# Altium schematic sheet POWER.SchDoc
size A4; SheetNumber: 4; SheetTotal: 4
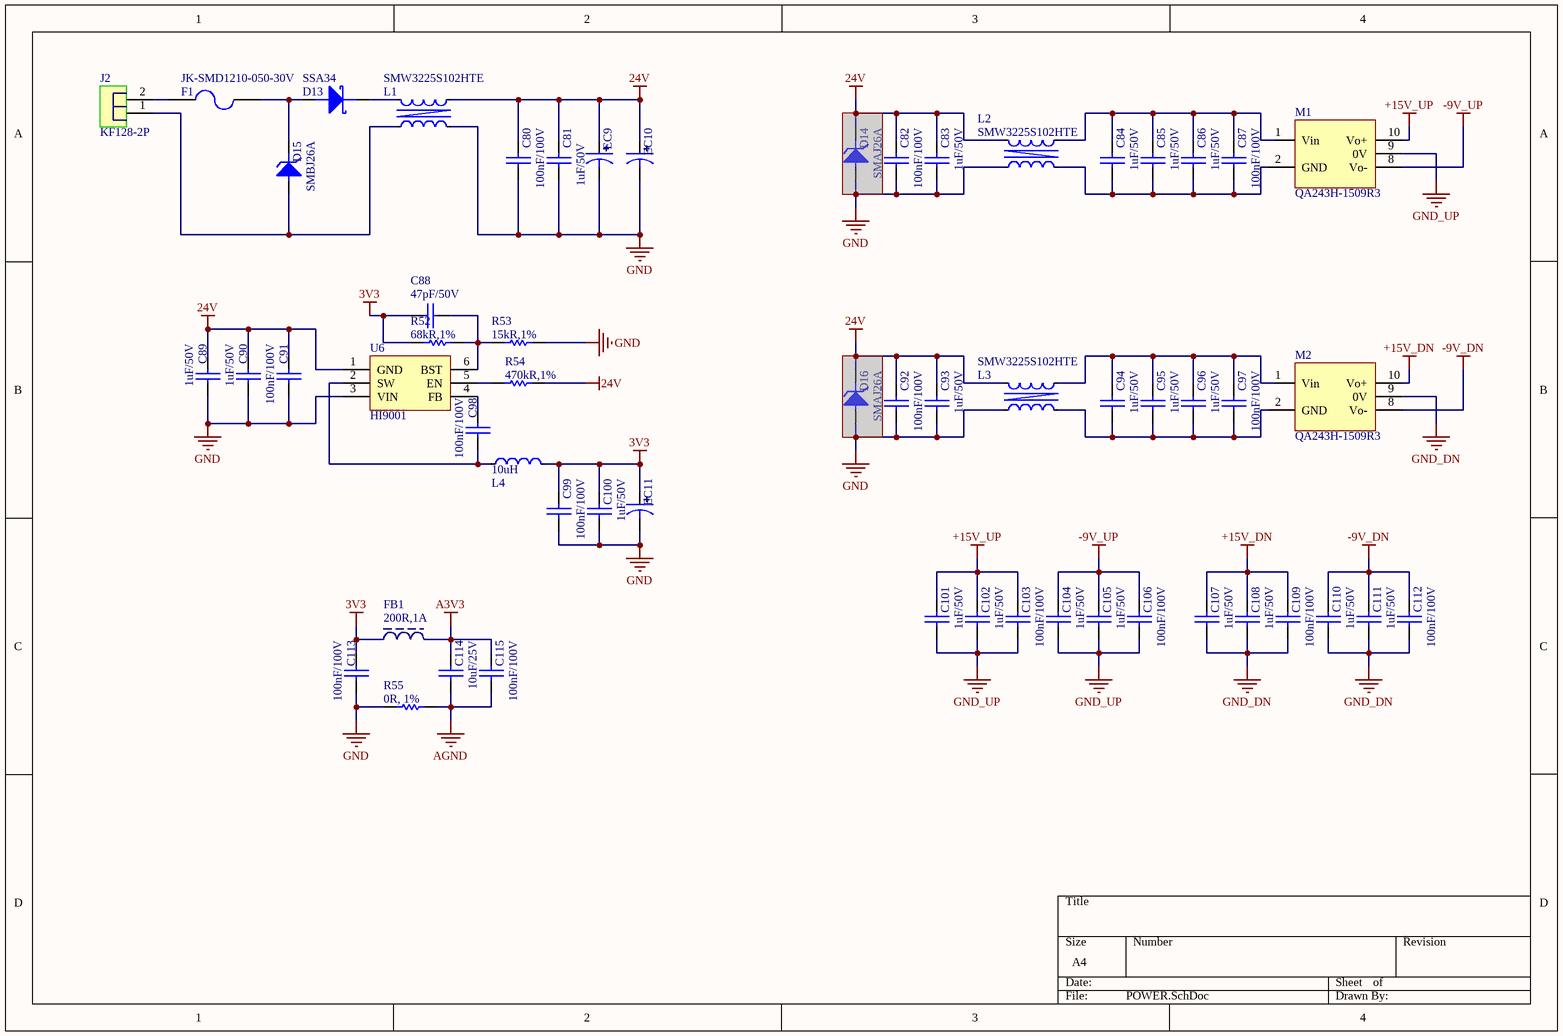
[diagram p0: POWER.SchDoc]

## Parts
C80  100nF/100V  [0603C]
C81  1uF/50V  [0603C]
C82  100nF/100V  [0603C]
C83  1uF/50V  [0603C]
C84  1uF/50V  [0603C]
C85  1uF/50V  [0603C]
C86  1uF/50V  [0603C]
C87  100nF/100V  [0603C]
C88  47pF/50V  [0603C]
C89  1uF/50V  [0603C]
C90  1uF/50V  [0603C]
C91  100nF/100V  [1206C]
C92  100nF/100V  [0603C]
C93  1uF/50V  [0603C]
C94  1uF/50V  [0603C]
C95  1uF/50V  [0603C]
C96  1uF/50V  [0603C]
C97  100nF/100V  [0603C]
C98  100nF/100V  [0603C]
C99  100nF/100V  [0603C]
C100  1uF/50V  [0603C]
C101  1uF/50V  [0603C]
C102  1uF/50V  [0603C]
C103  100nF/100V  [0603C]
C104  1uF/50V  [0603C]
C105  1uF/50V  [0603C]
C106  100nF/100V  [0603C]
C107  1uF/50V  [0603C]
C108  1uF/50V  [0603C]
C109  100nF/100V  [0603C]
C110  1uF/50V  [0603C]
C111  1uF/50V  [0603C]
C112  100nF/100V  [0603C]
C113  100nF/100V  [0603C]
C114  10uF/25V  [0603C]
C115  100nF/100V  [0603C]
D13  SSA34  [SMA/DO-214AC]
D14  SMAJ26A  [SMA/DO-214AC]  (masked out: inside a compile mask, not in the netlist)
D15  SMBJ26A  [SMB/DO-214AA]
D16  SMAJ26A  [SMA/DO-214AC]  (masked out: inside a compile mask, not in the netlist)
EC9  MA50V22M6X6  [CAPAE660X650L275X70N]  (value not drawn)
EC10  MA50V22M6X6  [CAPAE660X650L275X70N]  (value not drawn)
EC11  MA50V22M6X6  [CAPAE660X650L275X70N]  (value not drawn)
F1  JK-SMD1210-050-30V  [FUSE-1210]
FB1  200R,1A  [0603]
J2  KF128-2P  [KF128-3.81-2P]
L1  SMW3225S102HTE  [INDDFN4_320X250X240L65X80N]
L2  SMW3225S102HTE  [INDDFN4_320X250X240L65X80N]
L3  SMW3225S102HTE  [INDDFN4_320X250X240L65X80N]
L4  10uH  [L0530]
M1  QA243H-1509R3  [QAxx3H-R3]
M2  QA243H-1509R3  [QAxx3H-R3]
R52  68kR,1%  [0603R]
R53  15kR,1%  [0603R]
R54  470kR,1%  [0603R]
R55  0R, 1%  [0603R]
U6  HI9001  [SOT23-6]

## Nets
3V3: C88.1 C99.1 C100.1 C113.1 EC11.1 FB1.1 L4.2 R52.1
24V: C80.2 C81.1 C82.2 C83.1 C89.1 C90.1 C91.1 C92.2 C93.1 EC9.1 EC10.1 L1.4 L2.2 L3.1 R54.1 U6.1(GND)
+15V_DN: C107.1 C108.1 C109.2 M2.10(Vo+)
+15V_UP: C101.1 C102.1 C103.2 M1.10(Vo+)
-9V_DN: C110.1 C111.1 C112.2 M2.8(Vo-)
-9V_UP: C104.1 C105.1 C106.2 M1.8(Vo-)
A3V3: C114.1 C115.1 FB1.2
AGND: C114.2 C115.2 R55.2
GND: C80.1 C81.2 C82.1 C83.2 C89.2 C90.2 C91.2 C92.1 C93.2 C99.2 C100.2 C113.2 EC9.2 EC10.2 EC11.2 L1.3 L2.1 L3.2 R53.2 R55.1 U6.3(VIN)
GND_DN: C107.2 C108.2 C109.1 C110.2 C111.2 C112.1 M2.9(0V)
GND_UP: C101.2 C102.2 C103.1 C104.2 C105.2 C106.1 M1.9(0V)
NetC84_1: C84.1 C85.1 C86.1 C87.2 L2.3 M1.1(Vin)
NetC84_2: C84.2 C85.2 C86.2 C87.1 L2.4 M1.2(GND)
NetC88_2: C88.2 R52.2 R53.1 U6.6(BST)
NetC94_1: C94.1 C95.1 C96.1 C97.2 L3.4 M2.1(Vin)
NetC94_2: C94.2 C95.2 C96.2 C97.1 L3.3 M2.2(GND)
NetC98_1: C98.1 L4.1 U6.2(SW)
NetC98_2: C98.2 U6.4(FB)
NetD13_A: D13.A D15.K F1.2
NetD13_K: D13.K L1.1
NetD15_A: D15.A J2.1 L1.2
NetF1_1: F1.1 J2.2
NetR54_2: R54.2 U6.5(EN)

## Library data of the parts
C80 C82 C87 C92 C97-C99 C103 C106 C109 C112 C113 C115 = CAP: CC0603KRX7R9BB104
C81 C83-C86 C89 C90 C93-C96 C100-C102 C104 C105 C107 C108 C110 C111 = CAP: CC0603KRX7R9BB105
C88 = CAP: CC0603FRNPO9BN470
C91 = CAP: CC1206KKX7R0BB104
C114 = CAP: CC0603MRX5R8BB106
D13 = DIODE SCHOTTKY: 肖特基二极管
D14-D16 = TVS: 单向瞬态抑制二极管
EC9-EC11 = SMD_ECAP: 22uF@50V， Iripple = 2.65A
F1 = FUSE
FB1 = 磁珠_1: PZ1608D201-1R0TF
J2 = KF128-2P: KF128L-3.81-2P
L1-L3 = SMW3225S102HTE: 1.2A; Manufacturer: cjiang(长江微电); Symbol: FXL0530-100-M; Add into BOM: yes; Value: 10uH; Tolerance: ±20%; Rated Current: 3.2A; Saturation Current (Isat): 3.5A; DC Resistance (DCR): 125mΩ; Type: 一体成型电感; Device: FXL0530-100-M; LCSC Part Name: 10uH ±20% 3.5A; Supplier Part: C177248; Manufacturer Part: FXL0530-100-M; Supplier Footprint: SMD,5.2x5.4mm; JLCPCB Part Class: Extended Part; Datasheet: https://atta.szlcsc.com/upload/public/pdf/source/20240426/3189EA8206330E2108542F9E34E540E7.pdf; Supplier: LCSC; Convert to PCB: yes
L4 = FXL0530-100-M: Manufacturer: cjiang(长江微电); Add into BOM: yes; Tolerance: ±20%; Rated Current: 3.2A; Saturation Current (Isat): 3.5A; DC Resistance (DCR): 125mΩ; Type: 一体成型电感; Symbol: FXL0530-100-M; Device: FXL0530-100-M; LCSC Part Name: 10uH ±20% 3.5A; Supplier Part: C177248; Manufacturer Part: FXL0530-100-M; Supplier Footprint: SMD,5.2x5.4mm; JLCPCB Part Class: Extended Part; Datasheet: https://atta.szlcsc.com/upload/public/pdf/source/20240426/3189EA8206330E2108542F9E34E540E7.pdf; Supplier: LCSC; Convert to PCB: yes; Value: 10uH
M1 M2 = QAxx3H-R3: IN=24VDC, OUT=+15VDC/-9VDC
R52 = RES: RC0603FR-0768KL
R53 = RES: RT0603BRD0715KL
R54 = RES: RC0603FR-07470KL
R55 = RES: RC0603FR-070RL
U6 = HI9001: DC/DC converter controller